# Altium schematic sheet MainBoard_AD9835.SchDoc
size A
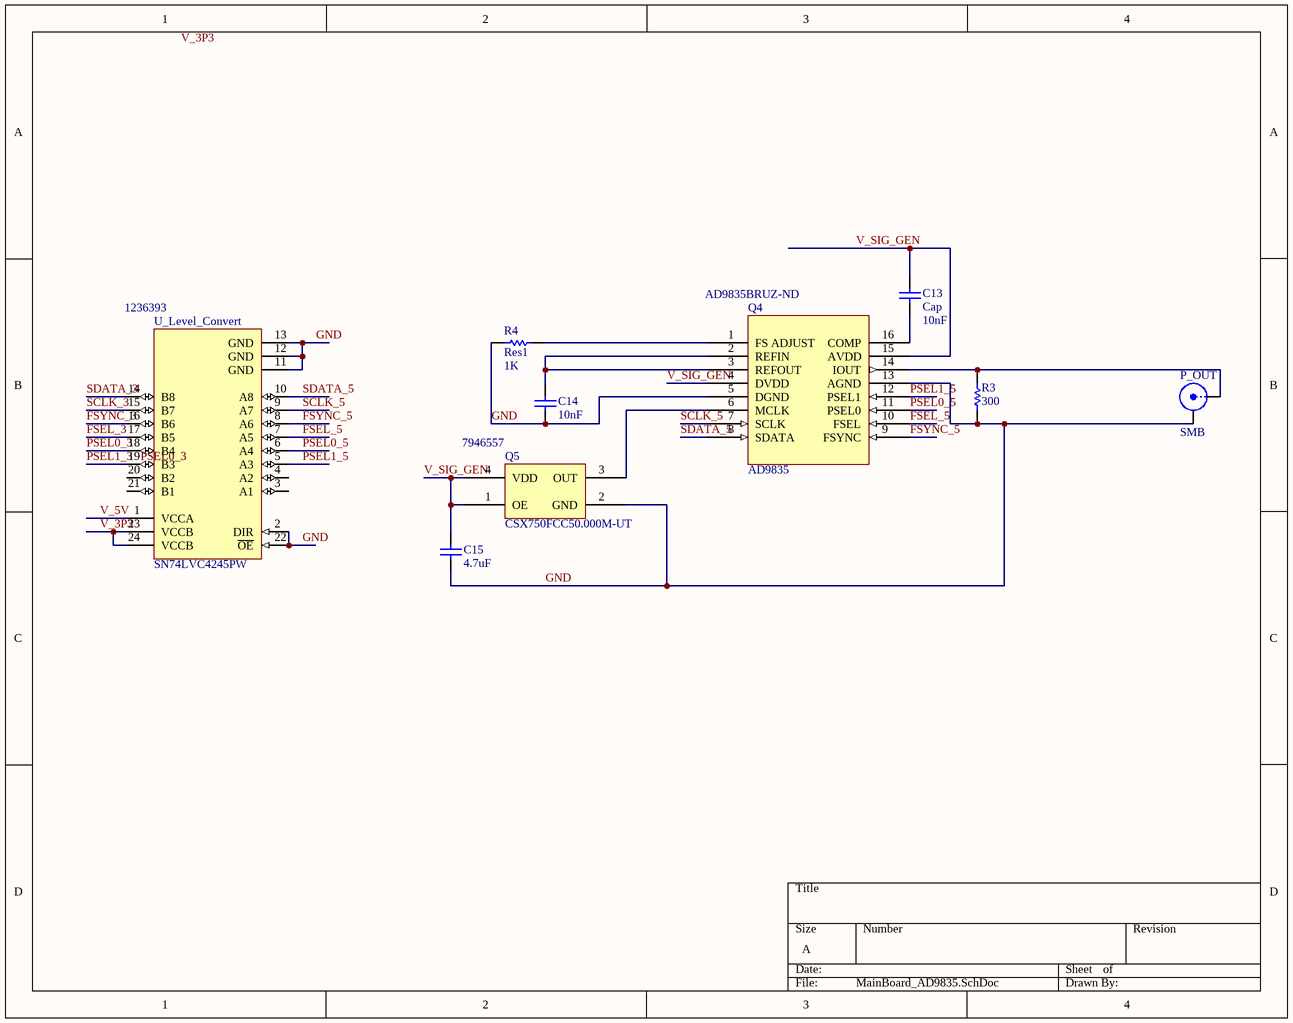
[diagram p0: MainBoard_AD9835.SchDoc]

## Parts
C13  Cap  value 10nF  [CAPR2.54-5.1x3.2]
C14  value 10nF  [CAPR2.54-5.1x3.2]  (hidden comment: Cap)
C15  value 4.7uF  [CAPR2.54-5.1x3.2]  (hidden comment: Cap)
P_OUT  SMB  [SMB_V-RJ45]
Q4  AD9835  Supplier Part Number 1: AD9835BRUZ-ND  [TSSOP16]
Q5  CSX750FCC50.000M-UT  Supplier Part Number 1: 7946557  [CSX750]
R3  value 300  [AXIAL-0.3]  (hidden comment: Res1)
R4  Res1  value 1K  [AXIAL-0.3]
U_Level_Convert  SN74LVC4245PW  Supplier Part Number 1: 1236393  [PW024]

## Nets
FSEL_3: U_Level_Convert.17(B5)
FSEL_5: Q4.10(FSEL) U_Level_Convert.7(A5)
FSYNC_3: U_Level_Convert.16(B6)
FSYNC_5: Q4.9(FSYNC) U_Level_Convert.8(A6)
GND: C14.1 C15.1 P_OUT.2(Y) Q4.5(DGND) Q4.13(AGND) Q5.2(GND) R3.1 R4.1 U_Level_Convert.2(DIR) U_Level_Convert.11(GND) U_Level_Convert.12(GND) U_Level_Convert.13(GND) U_Level_Convert.22(~{OE})
PSEL0_3: U_Level_Convert.18(B4)
PSEL0_5: Q4.11(PSEL0) U_Level_Convert.6(A4)
PSEL1_3: U_Level_Convert.19(B3)
PSEL1_5: Q4.12(PSEL1) U_Level_Convert.5(A3)
SCLK_3: U_Level_Convert.15(B7)
SCLK_5: Q4.7(SCLK) U_Level_Convert.9(A7)
SDATA_3: U_Level_Convert.14(B8)
SDATA_5: Q4.8(SDATA) U_Level_Convert.10(A8)
V_3P3: U_Level_Convert.23(VCCB) U_Level_Convert.24(VCCB)
V_5V: U_Level_Convert.1(VCCA)
V_SIG_GEN: C13.2 C15.2 Q4.4(DVDD) Q4.15(AVDD) Q5.1(OE) Q5.4(VDD)
NetC13_1: C13.1 Q4.16(COMP)
NetC14_2: C14.2 Q4.2(REFIN) Q4.3(REFOUT)
NetP_OUT_1: P_OUT.1(X) Q4.14(IOUT) R3.2
NetQ4_1: Q4.1(FS_ADJUST) R4.2
NetQ4_6: Q4.6(MCLK) Q5.3(OUT)

Not connected (* = marked no-connect by the designer): U_Level_Convert 3(A1) 4(A2) 20(B2) 21(B1)

## Notes on the sheet
- Labels drawn without touching a wire or pin: PSEL0_3, V_3P3

## Library data of the parts
C13-C15 = Cap: Capacitor; Published: 8-Jun-2000; LatestRevisionDate: 17-Jul-2002; LatestRevisionNote: Re-released for DXP Platform.; PackageReference: RAD-0.3; Publisher: Altium Limited
P_OUT = SMB: SMB Straight Connector; LatestRevisionDate: 17-Jul-2002; LatestRevisionNote: Re-released for DXP Platform.; Publisher: Altium Limited
R3 R4 = Res1: Resistor; Published: 8-Jun-2000; LatestRevisionDate: 17-Jul-2002; LatestRevisionNote: Re-released for DXP Platform.; PackageReference: AXIAL-0.3; Publisher: Altium Limited
U_Level_Convert = SN74LVC4245PW: Octal Bus Transceiver and 3.3-V to 5-V Shifter with 3-State Outputs; Published: 8-Jun-2000; LatestRevisionDate: 04-Mar-2005; LatestRevisionNote: Stylized 3D Model Added.; DatasheetVersion: Jan-1997; PackageVersion: Feb-1999; PackageReference: PW024; Publisher: Altium Limited; PackageDescription: Shrink Small Outline; 24 Leads; Body Width 4.4 mm; Pitch 0.65 mm; ComponentLink1Description: Manufacturer Link; ComponentLink1URL: http://www.ti.com/; Supplier 1: Farnell
Q4 = AD9835: Supplier 1: Digi-Key
Q5 = CSX750FCC50.000M-UT: Supplier 1: Farnell